# EAGLE design charliewatch-bicolor (EAGLE 7.7.0)
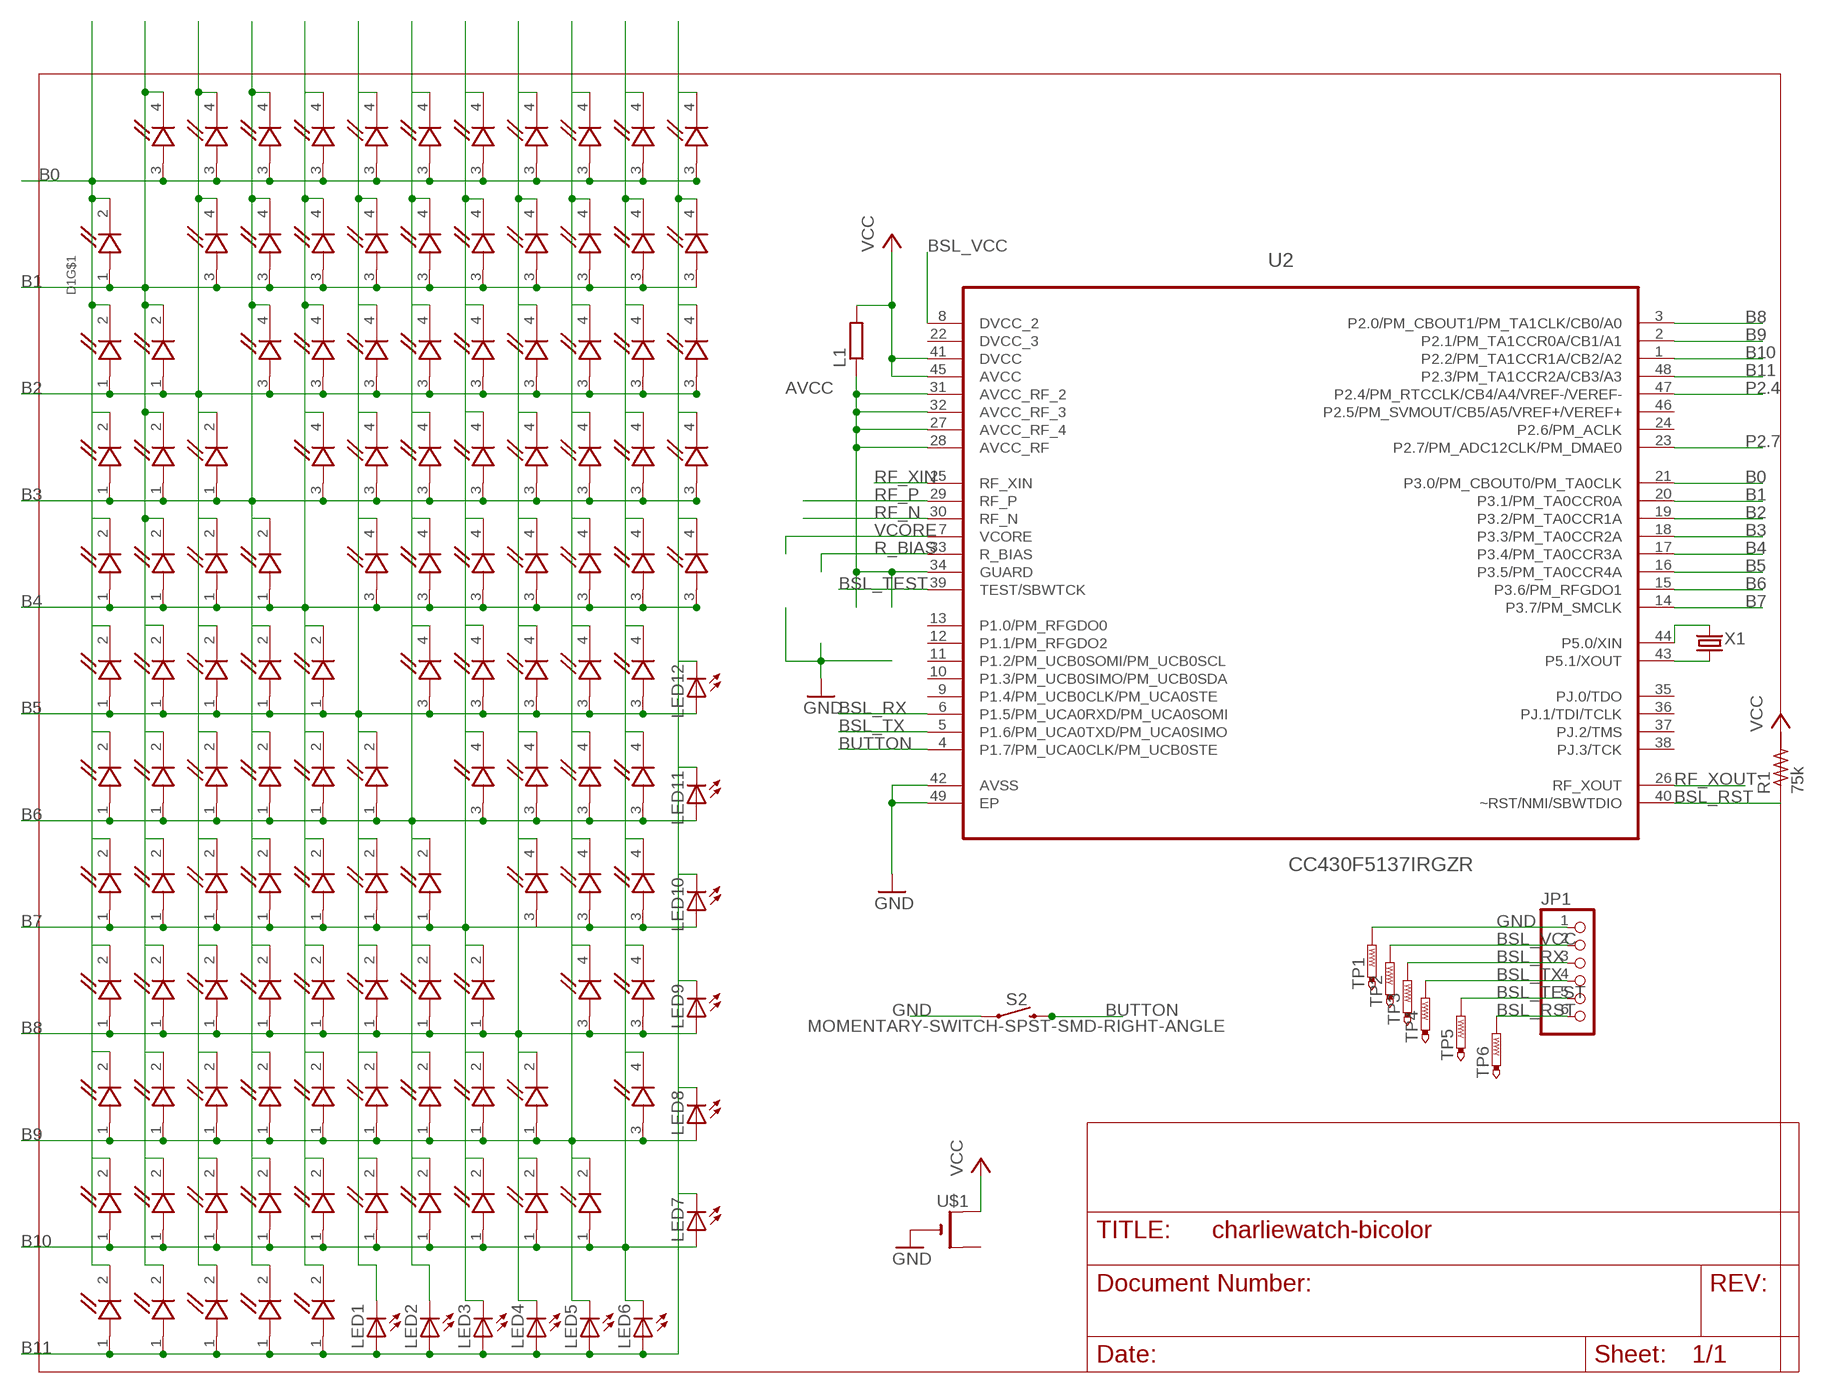
[diagram p0: schematic, sheet 1]

## Parts
D1  APHB1608SYKSURKC  [LED_APHB1608SYKSURKC]
D2  APHB1608SYKSURKC  [LED_APHB1608SYKSURKC]
D3  APHB1608SYKSURKC  [LED_APHB1608SYKSURKC]
D4  APHB1608SYKSURKC  [LED_APHB1608SYKSURKC]
D5  APHB1608SYKSURKC  [LED_APHB1608SYKSURKC]
D6  APHB1608SYKSURKC  [LED_APHB1608SYKSURKC]
D7  APHB1608SYKSURKC  [LED_APHB1608SYKSURKC]
D8  APHB1608SYKSURKC  [LED_APHB1608SYKSURKC]
D9  APHB1608SYKSURKC  [LED_APHB1608SYKSURKC]
D10  APHB1608SYKSURKC  [LED_APHB1608SYKSURKC]
D11  APHB1608SYKSURKC  [LED_APHB1608SYKSURKC]
D12  APHB1608SYKSURKC  [LED_APHB1608SYKSURKC]
D13  APHB1608SYKSURKC  [LED_APHB1608SYKSURKC]
D14  APHB1608SYKSURKC  [LED_APHB1608SYKSURKC]
D15  APHB1608SYKSURKC  [LED_APHB1608SYKSURKC]
D16  APHB1608SYKSURKC  [LED_APHB1608SYKSURKC]
D17  APHB1608SYKSURKC  [LED_APHB1608SYKSURKC]
D18  APHB1608SYKSURKC  [LED_APHB1608SYKSURKC]
D19  APHB1608SYKSURKC  [LED_APHB1608SYKSURKC]
D20  APHB1608SYKSURKC  [LED_APHB1608SYKSURKC]
D21  APHB1608SYKSURKC  [LED_APHB1608SYKSURKC]
D22  APHB1608SYKSURKC  [LED_APHB1608SYKSURKC]
D23  APHB1608SYKSURKC  [LED_APHB1608SYKSURKC]
D24  APHB1608SYKSURKC  [LED_APHB1608SYKSURKC]
D25  APHB1608SYKSURKC  [LED_APHB1608SYKSURKC]
D26  APHB1608SYKSURKC  [LED_APHB1608SYKSURKC]
D27  APHB1608SYKSURKC  [LED_APHB1608SYKSURKC]
D28  APHB1608SYKSURKC  [LED_APHB1608SYKSURKC]
D29  APHB1608SYKSURKC  [LED_APHB1608SYKSURKC]
D30  APHB1608SYKSURKC  [LED_APHB1608SYKSURKC]
D31  APHB1608SYKSURKC  [LED_APHB1608SYKSURKC]
D32  APHB1608SYKSURKC  [LED_APHB1608SYKSURKC]
D33  APHB1608SYKSURKC  [LED_APHB1608SYKSURKC]
D34  APHB1608SYKSURKC  [LED_APHB1608SYKSURKC]
D35  APHB1608SYKSURKC  [LED_APHB1608SYKSURKC]
D36  APHB1608SYKSURKC  [LED_APHB1608SYKSURKC]
D37  APHB1608SYKSURKC  [LED_APHB1608SYKSURKC]
D38  APHB1608SYKSURKC  [LED_APHB1608SYKSURKC]
D39  APHB1608SYKSURKC  [LED_APHB1608SYKSURKC]
D40  APHB1608SYKSURKC  [LED_APHB1608SYKSURKC]
D41  APHB1608SYKSURKC  [LED_APHB1608SYKSURKC]
D42  APHB1608SYKSURKC  [LED_APHB1608SYKSURKC]
D43  APHB1608SYKSURKC  [LED_APHB1608SYKSURKC]
D44  APHB1608SYKSURKC  [LED_APHB1608SYKSURKC]
D45  APHB1608SYKSURKC  [LED_APHB1608SYKSURKC]
D46  APHB1608SYKSURKC  [LED_APHB1608SYKSURKC]
D47  APHB1608SYKSURKC  [LED_APHB1608SYKSURKC]
D48  APHB1608SYKSURKC  [LED_APHB1608SYKSURKC]
D49  APHB1608SYKSURKC  [LED_APHB1608SYKSURKC]
D50  APHB1608SYKSURKC  [LED_APHB1608SYKSURKC]
D51  APHB1608SYKSURKC  [LED_APHB1608SYKSURKC]
D52  APHB1608SYKSURKC  [LED_APHB1608SYKSURKC]
D53  APHB1608SYKSURKC  [LED_APHB1608SYKSURKC]
D54  APHB1608SYKSURKC  [LED_APHB1608SYKSURKC]
D55  APHB1608SYKSURKC  [LED_APHB1608SYKSURKC]
D56  APHB1608SYKSURKC  [LED_APHB1608SYKSURKC]
D57  APHB1608SYKSURKC  [LED_APHB1608SYKSURKC]
D58  APHB1608SYKSURKC  [LED_APHB1608SYKSURKC]
D59  APHB1608SYKSURKC  [LED_APHB1608SYKSURKC]
D60  APHB1608SYKSURKC  [LED_APHB1608SYKSURKC]
JP1  PINHD-1X6LOCK  [1X06-BIGLOCK]
L1  R-EU_R0603  [R0603]
LED1  LEDCHIPLED_0805  [CHIPLED_0805]
LED2  LEDCHIPLED_0805  [CHIPLED_0805]
LED3  LEDCHIPLED_0805  [CHIPLED_0805]
LED4  LEDCHIPLED_0805  [CHIPLED_0805]
LED5  LEDCHIPLED_0805  [CHIPLED_0805]
LED6  LEDCHIPLED_0805  [CHIPLED_0805]
LED7  LEDCHIPLED_0805  [CHIPLED_0805]
LED8  LEDCHIPLED_0805  [CHIPLED_0805]
LED9  LEDCHIPLED_0805  [CHIPLED_0805]
LED10  LEDCHIPLED_0805  [CHIPLED_0805]
LED11  LEDCHIPLED_0805  [CHIPLED_0805]
LED12  LEDCHIPLED_0805  [CHIPLED_0805]
R1  75k  R-US_R0402  [R0402]
S2  MOMENTARY-SWITCH-SPST-SMD-RIGHT-ANGLE  [TACTILE_SWITCH_SMD_RIGHT_ANGLE]
TP1  PTR1TP10SQ  [TP10SQ]
TP2  PTR1TP10R  [TP10R]
TP3  PTR1TP10R  [TP10R]
TP4  PTR1TP10R  [TP10R]
TP5  PTR1TP10R  [TP10R]
TP6  PTR1TP10R  [TP10R]
U2  CC430F5137IRGZR  [QFN50P700X700X100-49N]
U$1  CR2032THM  [CR2032-THRU]
X1  CRYSTALS-NOGND-IQXC-25  [2.0X1.2-2PAD]

## Nets
AVCC: L1.1 U2.27(AVCC_RF_4) U2.28(AVCC_RF) U2.31(AVCC_RF_2) U2.32(AVCC_RF_3) U2.34(GUARD)
B0: D1.2(Y_C) D1.3(R_A) D2.2(Y_C) D2.3(R_A) D3.2(Y_C) D3.3(R_A) D5.2(Y_C) D5.3(R_A) D7.2(Y_C) D7.3(R_A) D10.2(Y_C) D10.3(R_A) D13.2(Y_C) D13.3(R_A) D17.2(Y_C) D17.3(R_A) D21.2(Y_C) D21.3(R_A) D26.2(Y_C) D26.3(R_A) D31.2(Y_C) D31.3(R_A) U2.21(P3.0/PM_CBOUT0/PM_TA0CLK)
B1: D1.1(Y_A) D1.4(R_C) D4.2(Y_C) D4.3(R_A) D6.2(Y_C) D6.3(R_A) D8.2(Y_C) D8.3(R_A) D11.2(Y_C) D11.3(R_A) D14.2(Y_C) D14.3(R_A) D18.2(Y_C) D18.3(R_A) D22.2(Y_C) D22.3(R_A) D27.2(Y_C) D27.3(R_A) D32.2(Y_C) D32.3(R_A) D37.2(Y_C) D37.3(R_A) U2.20(P3.1/PM_TA0CCR0A)
B2: D2.1(Y_A) D2.4(R_C) D4.1(Y_A) D4.4(R_C) D9.2(Y_C) D9.3(R_A) D12.2(Y_C) D12.3(R_A) D15.2(Y_C) D15.3(R_A) D19.2(Y_C) D19.3(R_A) D23.2(Y_C) D23.3(R_A) D28.2(Y_C) D28.3(R_A) D33.2(Y_C) D33.3(R_A) D38.2(Y_C) D38.3(R_A) D42.2(Y_C) D42.3(R_A) U2.19(P3.2/PM_TA0CCR1A)
B3: D3.1(Y_A) D3.4(R_C) D6.1(Y_A) D6.4(R_C) D9.1(Y_A) D9.4(R_C) D16.2(Y_C) D16.3(R_A) D20.2(Y_C) D20.3(R_A) D24.2(Y_C) D24.3(R_A) D29.2(Y_C) D29.3(R_A) D34.2(Y_C) D34.3(R_A) D39.2(Y_C) D39.3(R_A) D43.2(Y_C) D43.3(R_A) D47.2(Y_C) D47.3(R_A) U2.18(P3.3/PM_TA0CCR2A)
B4: D5.1(Y_A) D5.4(R_C) D8.1(Y_A) D8.4(R_C) D12.1(Y_A) D12.4(R_C) D16.1(Y_A) D16.4(R_C) D25.2(Y_C) D25.3(R_A) D30.2(Y_C) D30.3(R_A) D35.2(Y_C) D35.3(R_A) D40.2(Y_C) D40.3(R_A) D44.2(Y_C) D44.3(R_A) D48.2(Y_C) D48.3(R_A) D51.2(Y_C) D51.3(R_A) U2.17(P3.4/PM_TA0CCR3A)
B5: D7.1(Y_A) D7.4(R_C) D11.1(Y_A) D11.4(R_C) D15.1(Y_A) D15.4(R_C) D20.1(Y_A) D20.4(R_C) D25.1(Y_A) D25.4(R_C) D36.2(Y_C) D36.3(R_A) D41.2(Y_C) D41.3(R_A) D45.2(Y_C) D45.3(R_A) D49.2(Y_C) D49.3(R_A) D52.2(Y_C) D52.3(R_A) LED1.C LED12.A U2.16(P3.5/PM_TA0CCR4A)
B6: D10.1(Y_A) D10.4(R_C) D14.1(Y_A) D14.4(R_C) D19.1(Y_A) D19.4(R_C) D24.1(Y_A) D24.4(R_C) D30.1(Y_A) D30.4(R_C) D36.1(Y_A) D36.4(R_C) D46.2(Y_C) D46.3(R_A) D50.2(Y_C) D50.3(R_A) D53.2(Y_C) D53.3(R_A) D56.2(Y_C) D56.3(R_A) LED2.C LED11.A U2.15(P3.6/PM_RFGDO1)
B7: D13.1(Y_A) D13.4(R_C) D18.1(Y_A) D18.4(R_C) D23.1(Y_A) D23.4(R_C) D29.1(Y_A) D29.4(R_C) D35.1(Y_A) D35.4(R_C) D41.1(Y_A) D41.4(R_C) D46.1(Y_A) D46.4(R_C) D54.2(Y_C) D57.2(Y_C) D57.3(R_A) D59.2(Y_C) D59.3(R_A) LED10.A U2.14(P3.7/PM_SMCLK)
B8: D17.1(Y_A) D17.4(R_C) D22.1(Y_A) D22.4(R_C) D28.1(Y_A) D28.4(R_C) D34.1(Y_A) D34.4(R_C) D40.1(Y_A) D40.4(R_C) D45.1(Y_A) D45.4(R_C) D50.1(Y_A) D50.4(R_C) D54.1(Y_A) D54.4(R_C) D55.2(Y_C) D55.3(R_A) D60.2(Y_C) D60.3(R_A) LED9.A U2.3(P2.0/PM_CBOUT1/PM_TA1CLK/CB0/A0)
B9: D21.1(Y_A) D21.4(R_C) D27.1(Y_A) D27.4(R_C) D33.1(Y_A) D33.4(R_C) D39.1(Y_A) D39.4(R_C) D44.1(Y_A) D44.4(R_C) D49.1(Y_A) D49.4(R_C) D53.1(Y_A) D53.4(R_C) D57.1(Y_A) D57.4(R_C) D58.2(Y_C) D58.3(R_A) D60.1(Y_A) D60.4(R_C) LED8.A U2.2(P2.1/PM_TA1CCR0A/CB1/A1)
B10: D26.1(Y_A) D26.4(R_C) D32.1(Y_A) D32.4(R_C) D38.1(Y_A) D38.4(R_C) D43.1(Y_A) D43.4(R_C) D48.1(Y_A) D48.4(R_C) D52.1(Y_A) D52.4(R_C) D55.1(Y_A) D55.4(R_C) D56.1(Y_A) D56.4(R_C) D58.1(Y_A) D58.4(R_C) D59.1(Y_A) D59.4(R_C) LED7.A U2.1(P2.2/PM_TA1CCR1A/CB2/A2)
B11: D31.1(Y_A) D31.4(R_C) D37.1(Y_A) D37.4(R_C) D42.1(Y_A) D42.4(R_C) D47.1(Y_A) D47.4(R_C) D51.1(Y_A) D51.4(R_C) LED1.A LED2.A LED3.A LED4.A LED5.A LED6.A U2.48(P2.3/PM_TA1CCR2A/CB3/A3)
BSL_RST: JP1.6 R1.1 TP6.TP U2.40(~RST/NMI/SBWTDIO)
BSL_RX: JP1.3 TP3.TP U2.6(P1.5/PM_UCA0RXD/PM_UCA0SOMI)
BSL_TEST: JP1.5 TP5.TP U2.39(TEST/SBWTCK)
BSL_TX: JP1.4 TP4.TP U2.5(P1.6/PM_UCA0TXD/PM_UCA0SIMO)
BSL_VCC: JP1.2 TP2.TP U2.8(DVCC_2)
BUTTON: S2.2 U2.4(P1.7/PM_UCA0CLK/PM_UCB0STE)
GND: JP1.1 S2.1 TP1.TP U2.42(AVSS) U2.49(EP) U$1.-
P2.4: U2.47(P2.4/PM_RTCCLK/CB4/A4/VREF-/VEREF-)
P2.7: U2.23(P2.7/PM_ADC12CLK/PM_DMAE0)
R_BIAS: U2.33(R_BIAS)
RF_N: U2.30(RF_N)
RF_P: U2.29(RF_P)
RF_XIN: U2.25(RF_XIN)
RF_XOUT: U2.26(RF_XOUT)
VCC: L1.2 R1.2 U2.41(DVCC) U2.45(AVCC) U$1.+1(+)
VCORE: U2.7(VCORE)
XIN: U2.44(P5.0/XIN) X1.2
XOUT: U2.43(P5.1/XOUT) X1.1
Unconnected: D54.3(R_A) LED3.C LED4.C LED5.C LED6.C LED7.C LED8.C LED9.C LED10.C LED11.C LED12.C U2.9(P1.4/PM_UCB0CLK/PM_UCA0STE) U2.10(P1.3/PM_UCB0SIMO/PM_UCB0SDA) U2.11(P1.2/PM_UCB0SOMI/PM_UCB0SCL) U2.12(P1.1/PM_RFGDO2) U2.13(P1.0/PM_RFGDO0) U2.24(P2.6/PM_ACLK) U2.35(PJ.0/TDO) U2.36(PJ.1/TDI/TCLK) U2.37(PJ.2/TMS) U2.38(PJ.3/TCK) U2.46(P2.5/PM_SVMOUT/CB5/A5/VREF+/VEREF+) U$1.+2(+1)

## Power pins joined to a net without a drawn wire
DVCC_3: U2.22(DVCC_3)

## Library data of the parts
D1-D60 = APHB1608SYKSURKC:APHB1608SYKSURKC: Led; 3mm White High-Intensity Led; DESCRIPTION: Surface Mount LED; Size : 1.6X0.8mm _0603_; Color: Green / Yellow; Lens: Water Clear; DIGI-KEY_PART_NUMBER: 754-1855-1-ND; DIGI-KEY_PURCHASE_URL: https://www.digikey.nl/product-detail/en/kingbright/APHB1608SYKSURKC/754-1855-1-ND/4977027?utm_source=snapeda&utm_medium=aggregator&utm_campaign=symbol; MF: Kingbright; MP: APHB1608SYKSURKC; PACKAGE: 0603 Kingbright
JP1 = adafruit:PINHD-1X6: PIN HEADER
L1 = rcl:R-EU_: RESISTOR, European symbol
LED1-LED12 = led:LED: LED OSRAM: - CHIPLED LG R971, LG N971, LY N971, LG Q971, LY Q971, LO R971, LY R971 LH N974, LH R974 LS Q976, LO Q976, LY Q976 LO Q996 - Hyper CHIPLED LW Q18S LB Q993, LB Q99A, LB R99A - SideLED LS A670, LO A670, LY A670, LG A670, LP A670 LB A673, LV A673, LT A673, LW A673 LH A674 LY A675 LS A676, LA A676, LO A676, LY A676, LW A676 LS A679, LY A679, LG A679 - Hyper Micro SIDELED® LS Y876, LA Y876, LO Y876, LY Y876 LT Y87S - SmartLED LW L88C, LW L88S LB L89C, LB L89S, LG L890 LS L89K, LO L89K, LY L89K LS L896, LA L896, LO L896, LY L896 - TOPLED LS T670, LO T670, LY T670, LG T670, LP T670 LSG T670, LSP T670, LSY T670, LOP T670, LYG T670 LG T671, LOG T671, LSG T671 LB T673, LV T673, LT T673, LW T673 LH T674 LS T676, LA T676, LO T676, LY T676, LB T676, LH T676, LSB T676, LW T676 LB T67C, LV T67C, LT T67C, LS T67K, LO T67K, LY T67K, LW E67C LS E67B, LA E67B, LO E67B, LY E67B, LB E67C, LV E67C, LT E67C LW T67C LS T679, LY T679, LG T679 LS T770, LO T770, LY T770, LG T770, LP T770 LB T773, LV T773, LT T773, LW T773 LH T774 LS E675, LA E675, LY E675, LS T675 LS T776, LA T776, LO T776, LY T776, LB T776 LHGB T686 LT T68C, LB T68C - Hyper Mini TOPLED® LB M676 - Mini TOPLED Santana® LG M470 LS M47K, LO M47K, LY M47K Source: http://www.osram.convergy.de LUXEON: - LUMILED® LXK2-PW12-R00, LXK2-PW12-S00, LXK2-PW14-U00, LXK2-PW14-V00 LXK2-PM12-R00, LXK2-PM12-S00, LXK2-PM14-U00 LXK2-PE12-Q00, LXK2-PE12-R00, LXK2-PE12-S00, LXK2-PE14-T00, LXK2-PE14-U00 LXK2-PB12-K00, LXK2-PB12-L00, LXK2-PB12-M00, LXK2-PB14-N00, LXK2-PB14-P00, LXK2-PB14-Q00 LXK2-PR12-L00, LXK2-PR12-M00, LXK2-PR14-Q00, LXK2-PR14-R00 LXK2-PD12-Q00, LXK2-PD12-R00, LXK2-PD12-S00 LXK2-PH12-R00, LXK2-PH12-S00 LXK2-PL12-P00, LXK2-PL12-Q00, LXK2-PL12-R00 Source: www.luxeon.com KINGBRIGHT: KA-3528ASYC Source: www.kingbright.com
R1 = rcl:R-US_: RESISTOR, American symbol
S2 = SparkFun-Switches:MOMENTARY-SWITCH-SPST: Momentary Switch (Pushbutton) - SPST Normally-open (NO) SPST momentary switches (buttons, pushbuttons). Variants PTH-12MM - 12mm square, through-hole Momentary Pushbutton Switch - 12mm Square <https://www.sparkfun.com/products/9190> (COM-09190) PTH-6.0MM, PTH-6.0MM-KIT - 6.0mm square, through-hole Mini Pushbutton Switch <https://www.sparkfun.com/products/97> (COM-00097) KIT package intended for soldering kit's - only one side of pads' copper is exposed. PTH-RIGHT-ANGLE-KIT - Right-angle, through-hole Right Angle Tactile Button <https://www.sparkfun.com/products/10791> - Used on SparkFun BigTime Watch Kit <https://www.sparkfun.com/products/11734> SMD-12MM - 12mm square, surface-mount Tactile Button - SMD (12mm) <https://www.sparkfun.com/products/12993> (COM-12993) Used on SparkFun PicoBoard <https://www.sparkfun.com/products/11888> SMD-4.5MM - 4.5mm Square Trackball Switch Used on SparkFun Blackberry Trackballer Breakout <https://www.sparkfun.com/products/13169> SMD-4.6MMX2.8MM - 4.60mm x 2.80mm, surface mount Used on SparkFun SAMD21 Mini Breakout <https://www.sparkfun.com/products/13664> SMD-5.2MM, SMD-5.2-REDUNDANT - 5.2mm square, surface-mount Mini Pushbutton Switch - SMD <https://www.sparkfun.com/products/8720> (COM-08720) Used on Arduino Pro Mini <https://www.sparkfun.com/products/11114> REDUNDANT package connects both switch circuits together SMD-6.0X3.5MM - 6.0 x 3.5mm, surface mount Momentary Reset Switch SMD <https://www.sparkfun.com/products/8229> (COM-08229) SMD-6.2MM-TALL - 6.2mm square, surface mount Tactile Button - SMD (6mm) <https://www.sparkfun.com/products/12992> Used on SparkFun Digital Sandbox <https://www.sparkfun.com/products/12651> SMD-RIGHT-ANGLE - Right-angle, surface mount Used on SparkFun Block for Intel® Edison - Arduino <https://www.sparkfun.com/products/13036>; PROD_ID: COMP-12265
TP1-TP6 = testpad:PTR1: TEST PIN
U2 = Texas Instruments_By_element14_Batch_1:CC430F5137IRGZR: MSP430 SoC with RF Core; MPN: CC430F5137IRGZR; OC_FARNELL: -; OC_NEWARK: 68R5912; PACKAGE: QFN-48; SUPPLIER: TEXAS INSTRUMENTS
U$1 = adafruit:CR2032
X1 = IQD-Frequency-Products:CRYSTALS-NOGND: CRYSTALS CAN NOT GROUNDED

## Net classes
0 default: width 0.102 mm, drill 0.025 mm, clearance 0.025 mm

## Board
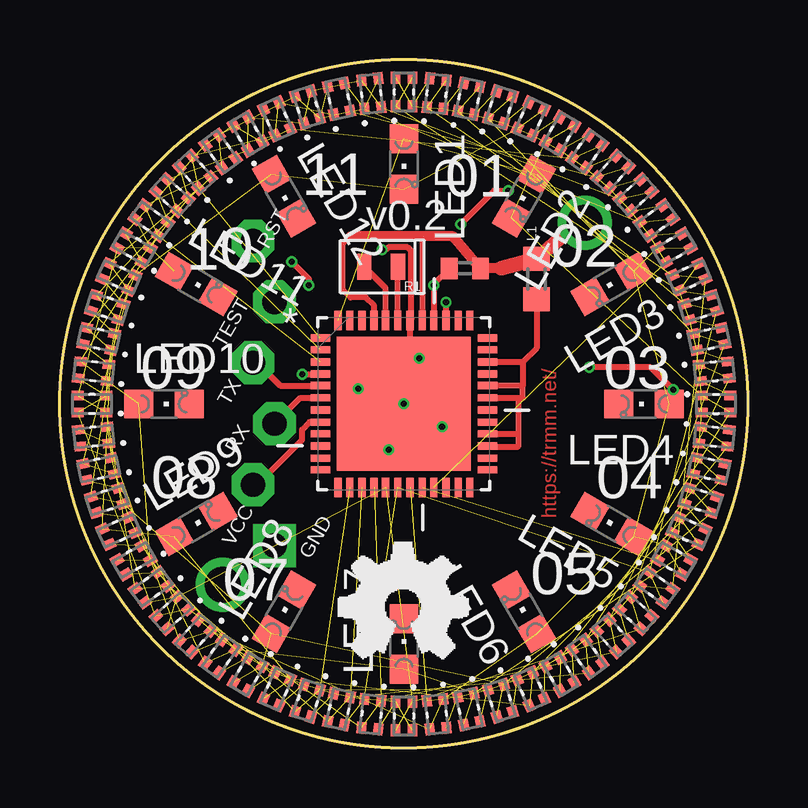
[diagram p1: board, top side]
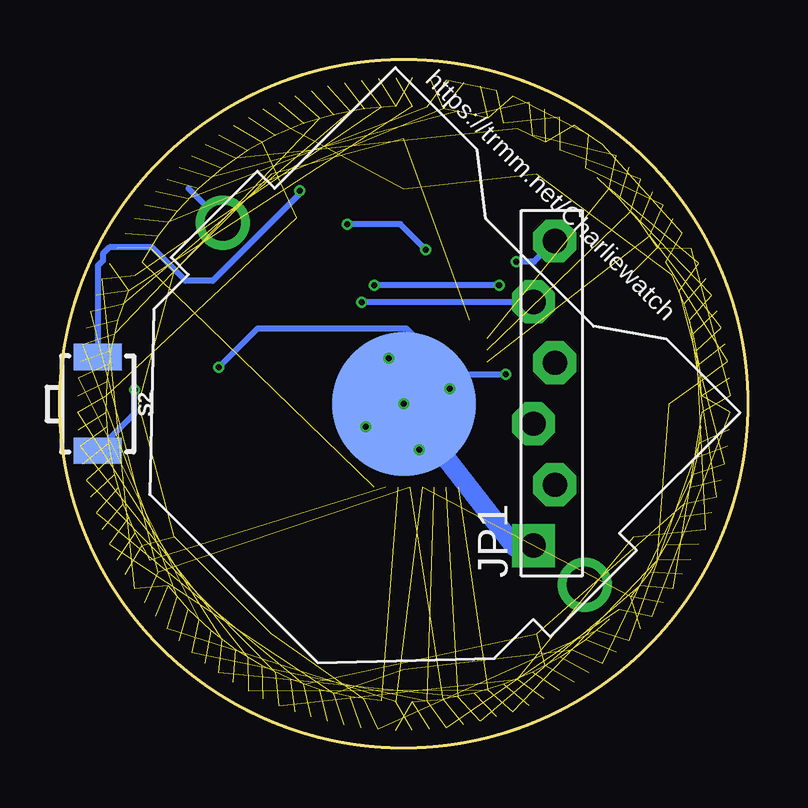
[diagram p2: board, bottom side, seen from below]

Size 28.66 x 28.66 mm. Coordinates in mm from the lower left corner, seen from the top.
Outline: circle at 14.33,14.33 radius 14.33
Copper layers (1*16): Top 0.035mm / dielectric 1.5mm / Bottom 0.035mm
Design rules "default *": minimum track width 10mil, minimum drill 10mil, track to track 5mil, track to pad 5mil, pad to pad 5mil, via to via 5mil, smd to smd 5mil, copper to edge 40mil, drill to drill 8mil, minimum pad ring 10mil, minimum via ring 4mil, stop-mask expansion 4mil, vias tented up to drill 15mil, thermal gap 10mil

### Footprints (pad centres in the part's own frame; a part is rotated, then mirrored left to right if it is on the bottom)
LED_APHB1608SYKSURKC = smd 0.5 x 0.4: 1 -0.6,0.35; 2 0.6,0.35; 3 -0.6,-0.35; 4 0.6,-0.35
1X06-BIGLOCK = drill 1.016 pad 1.778 square: 1 -6.35,0.762 | drill 1.016 pad 1.778 octagon: 2 -3.81,-0.127; 3 -1.27,0.762; 4 1.27,-0.127; 5 3.81,0.762; 6 6.35,-0.127
R0603 = smd 1 x 1.1: 1 -0.85,0; 2 0.85,0
CHIPLED_0805 = smd 1.2 x 1.2: A 0,-1.05; C 0,1.05
R0402 = smd 0.7 x 0.9: 1 -0.65,0; 2 0.65,0
TACTILE_SWITCH_SMD_RIGHT_ANGLE = smd 1.1 x 2: 1 -1.95,0; 2 1.95,0
TP10SQ = smd 1 x 1: TP 0,0
TP10R = smd 1 x 1: TP 0,0
QFN50P700X700X100-49N = smd 0.813 x 0.305: 1 -3.48,2.743; 2 -3.48,2.261; 3 -3.48,1.753; 4 -3.48,1.245; 5 -3.48,0.762; 6 -3.48,0.254; 7 -3.48,-0.254; 8 -3.48,-0.762; 9 -3.48,-1.245; 10 -3.48,-1.753; 11 -3.48,-2.261; 12 -3.48,-2.743; 25 3.48,-2.743; 26 3.48,-2.261; 27 3.48,-1.753; 28 3.48,-1.245; 29 3.48,-0.762; 30 3.48,-0.254; 31 3.48,0.254; 32 3.48,0.762; 33 3.48,1.245; 34 3.48,1.753; 35 3.48,2.261; 36 3.48,2.743 | smd 0.305 x 0.813: 13 -2.743,-3.48; 14 -2.261,-3.48; 15 -1.753,-3.48; 16 -1.245,-3.48; 17 -0.762,-3.48; 18 -0.254,-3.48; 19 0.254,-3.48; 20 0.762,-3.48; 21 1.245,-3.48; 22 1.753,-3.48; 23 2.261,-3.48; 24 2.743,-3.48; 37 2.743,3.48; 38 2.261,3.48; 39 1.753,3.48; 40 1.245,3.48; 41 0.762,3.48; 42 0.254,3.48; 43 -0.254,3.48; 44 -0.762,3.48; 45 -1.245,3.48; 46 -1.753,3.48; 47 -2.261,3.48; 48 -2.743,3.48 | smd 5.588 x 5.588: 49 0,0
CR2032-THRU = drill 1.5 pad 2: +1 -10.668,0; +2 10.668,0 | smd 6 x 6: - 0,0
2.0X1.2-2PAD = smd 0.6 x 1.1: 1 -0.7,0; 2 0.7,0

### Placement (x,y rotation side)
D1  14.33,27.33 90 top
D2  15.69,27.26 84 top
D3  17.03,27.05 78 top
D4  26.21,19.62 24 top
D5  18.35,26.7 72 top
D6  26.7,18.35 18 top
D7  19.62,26.21 66 top
D8  27.05,17.03 12 top
D9  24.85,6.69 324 top
D10  20.83,25.59 60 top
D11  27.26,15.69 6 top
D12  23.99,5.63 318 top
D13  21.97,24.85 54 top
D14  27.33,14.33 0 top
D15  23.03,4.67 312 top
D16  14.33,1.33 270 top
D17  23.03,23.99 48 top
D18  27.26,12.97 354 top
D19  21.97,3.81 306 top
D20  12.97,1.4 264 top
D21  23.99,23.03 42 top
D22  27.05,11.63 348 top
D23  20.83,3.07 300 top
D24  11.63,1.62 258 top
D25  4.67,5.63 222 top
D26  24.85,21.97 36 top
D27  26.7,10.31 342 top
D28  19.62,2.45 294 top
D29  10.31,1.97 252 top
D30  3.81,6.69 216 top
D31  25.59,20.83 30 top
D32  26.21,9.04 336 top
D33  18.35,1.97 288 top
D34  9.04,2.45 246 top
D35  3.07,7.83 210 top
D36  1.33,14.33 180 top
D37  25.59,7.83 330 top
D38  17.03,1.62 282 top
D39  7.83,3.07 240 top
D40  2.45,9.04 204 top
D41  1.4,15.69 174 top
D42  15.69,1.4 276 top
D43  6.69,3.81 234 top
D44  1.97,10.31 198 top
D45  1.62,17.03 168 top
D46  3.07,20.83 150 top
D47  5.63,4.67 228 top
D48  1.62,11.63 192 top
D49  1.97,18.35 162 top
D50  3.81,21.97 144 top
D51  1.4,12.97 186 top
D52  2.45,19.62 156 top
D53  4.67,23.03 138 top
D54  6.69,24.85 126 top
D55  11.63,27.05 102 top
D56  5.63,23.99 132 top
D57  7.83,25.59 120 top
D58  12.97,27.26 96 top
D59  9.04,26.21 114 top
D60  10.31,26.7 108 top
JP1  8.17,14.78 90 bottom
L1  19.86,19.54 90 top
LED1  14.33,24.33 180 top
LED2  19.33,22.99 150 top
LED3  22.99,19.33 120 top
LED4  24.33,14.33 90 top
LED5  22.99,9.33 60 top
LED6  19.33,5.67 30 top
LED7  14.33,4.33 0 top
LED8  9.33,5.67 330 top
LED9  5.67,9.33 300 top
LED10  4.33,14.33 270 top
LED11  5.67,19.33 240 top
LED12  9.33,22.99 210 top
R1  16.87,19.98 0 top
S2  27.09,14.33 270 bottom
TP1  8.87,8.43 0 top
TP2  8.23,10.97 0 top
TP3  8.87,13.51 0 top
TP4  8.23,16.05 0 top
TP5  8.87,18.59 0 top
TP6  8.23,21.13 0 top
U2  14.33,14.33 0 top
U$1  14.33,14.33 315 bottom
X1  13.38,20.05 180 top

### Tracks (layer width: path | path; a pad name or v marks a point on that pad's centre or on a via)
AVCC
  Top 0.254: U2.27 17.84,12.55 19.09,12.55 19.09,13.09 | U2.28 19.09,13.09 | U2.34 19.28,16.08 | 19.28,16.08 19.28,15.09 | 19.28,15.09 U2.32 | 19.28,15.09 19.28,14.58 U2.31 19.09,14.58 19.09,13.09 | L1.1 19.85,16.65 19.28,16.08
B0  (22 unrouted)
B1  (22 unrouted)
B2  (22 unrouted)
B3  (22 unrouted)
B4  (22 unrouted)
B5  (22 unrouted)
B6  (22 unrouted)
B7  (20 unrouted)
B8  (21 unrouted)
B9  (21 unrouted)
B10  (21 unrouted)
B11  (16 unrouted)
BSL_RST  (via drill 0.25)
  Top 0.254: U2.40 v15.58,19.28 15.58,19.33 R1.1 | TP6.TP 8.23,21.14 8.06,21.14 JP1.6 | v10.37,19.28 10.37,19.54 v9.66,20.25
  Bottom 0.254: v10.37,19.28 v15.58,19.28 | v9.66,20.25 8.92,20.25 JP1.6
BSL_RX
  Top 0.254: U2.6 10.01,14.58 JP1.3 8.82,13.52 8.23,13.52 TP3.TP
BSL_TEST  (via drill 0.25)
  Top 0.254: v16.08,18.57 U2.39 | TP5.TP 8.23,18.6 8.92,18.6 JP1.5
  Bottom 0.254: v16.08,18.57 8.95,18.57 JP1.5
BSL_TX
  Top 0.254: U2.5 9.17,15.09 TP4.TP 8.13,16.03 8.06,16.03 JP1.4
BSL_VCC
  Top 0.254: U2.8 10.39,13.57 10.09,13.26 10.09,12.83 8.23,10.98 TP2.TP 8.13,10.98 8.06,10.98 JP1.2
BUTTON  (via drill 0.25)
  Top 0.254: v10.09,15.58 U2.4 | v22.05,15.85 24.62,15.85 v25.56,14.91
  Bottom 0.254: v10.09,15.58 12.32,15.58 14.23,17.48 20.43,17.48 v22.05,15.85 | v25.56,14.91 25.56,13.92 27.08,12.4 S2.2
GND  (via drill 0.25)
  Top 0.254: 14.58,16.3 U$1.- | v12.43,14.97 U$1.- | v13.7,12.43 U$1.- | v14.97,16.24 U$1.- | v15.92,13.38 U$1.- | U$1.- 14.58,16.41 U2.42 14.64,17.91 14.64,20.71 14.48,20.86 13.67,20.86 13.57,20.76 v13.42,20.76 | v18.67,23.22 18.09,23.22 v16.69,21.82
  Top 0.61: U$1.- 12.43,12.43 12.43,12.11
  Bottom 0.254: TP1.TP 8.95,8.41 JP1.1 | v18.67,23.22 18.67,23.09 22.31,19.46 23.42,19.46 24.82,20.86 26.6,20.86 26.88,20.58 26.88,20.3 27.08,20.1 S2.1 | v16.69,21.82 14.48,21.82 v13.42,20.76
  Bottom 0.813: TP1.TP 9.7,8.36 U$1.-
  other vias: 14.33,14.33 8.87,8.43
VCC  (via drill 0.25)
  Top 0.254: U2.45 13.09,18.43 12.74,18.78 12.11,18.78 11.79,19.09 11.79,21 12.11,21.32 | 15.09,21.32 U2.41
  Top 0.406: L1.2 19.83,20.36 | 18.39,19.98 R1.2 16.39,21.32 15.09,21.32 12.11,21.32
  Top 0.61: 18.39,19.98 L1.2 v22.01,22.27
  Bottom 0.254: v22.01,22.27 22.03,22.28 22.28,22.28 23.3,23.3 U$1.+1
XIN
  Top 0.254: U2.44 13.57,19.15 X1.2
XOUT
  Top 0.254: U2.43 X1.1

### Text on the board
Top: https://trmm.net/
tNames: RST | 11 | 01 | v0.2 | 10 | 02 | TEST | 09 | 03 | TX | RX | 08 | GND | 04 | VCC | 07 | 05
bNames: https://trmm.net/Charliewatch
tStop: https://trmm.net/
Document: Don't forget change dimension circle to 0.5642